# Altium schematic sheet inputs.SchDoc
size A4; SheetNumber: 5; SheetTotal: 8
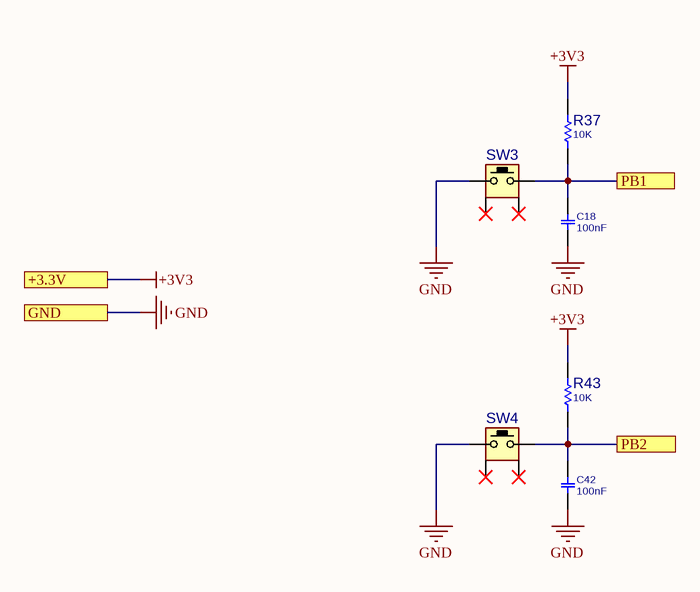
[diagram p0: inputs.SchDoc]

## Parts
C18  100nF  [C0805]
C42  100nF  [C0805]
R37  10K  [R0805]
R43  10K  [R0805]
SW3  PUSHBUTTON  [SWPBT_SPST_R_6X6X10]  (value not drawn)
SW4  PUSHBUTTON  [SWPBT_SPST_R_6X6X10]  (value not drawn)

## Ports
+3.3V, GND, PB1, PB2

## Nets
+3V3: R37.1 R43.1 ; port +3.3V
GND: C18.1 C42.1 SW3.1 SW4.1 ; port GND
PB1: C18.2 R37.2 SW3.2 ; port PB1
PB2: C42.2 R43.2 SW4.2 ; port PB2

Not connected (* = marked no-connect by the designer): SW3 MH1* MH2*; SW4 MH1* MH2*

## Library data of the parts
C18 C42 = CAP_SMD_MLCC_0805: CAP, MLCC, -F, -V, MATERIAL, -%, 0201; PARAM: -, -%; MANF_P#: MANF_PART#; PRICE: 100= 1$; MANF: -; PARAM2: -V; ASSEMBLY: ASSEMBLY; VALUE: 100nF
R37 R43 = RES_SMD_0805: RESISTOR, SMD; PARAM: -W; DESC: DESCRIPTION; DIST#: MOUSER; PARAM2: 1%; MANF_P#: -; MANF: -; ASSEMBLY: ASSEMBLY; PRICE: 100= 0.5$; VALUE: 10K
SW3 SW4 = SWPBT_SPST_R_6X6X10: SWITCH, PUSH BUTTON, TACTILE, THD, SPST, RIGHT; PARAM: 50mA/12VDC; DESC: DESCRIPTION; MANF: -; VALUE: PUSHBUTTON; ASSEMBLY: ASSEMBLY; PRICE: 0.3$; MANF_P#: -